# EAGLE design HRV_Control (EAGLE 7.7.0)
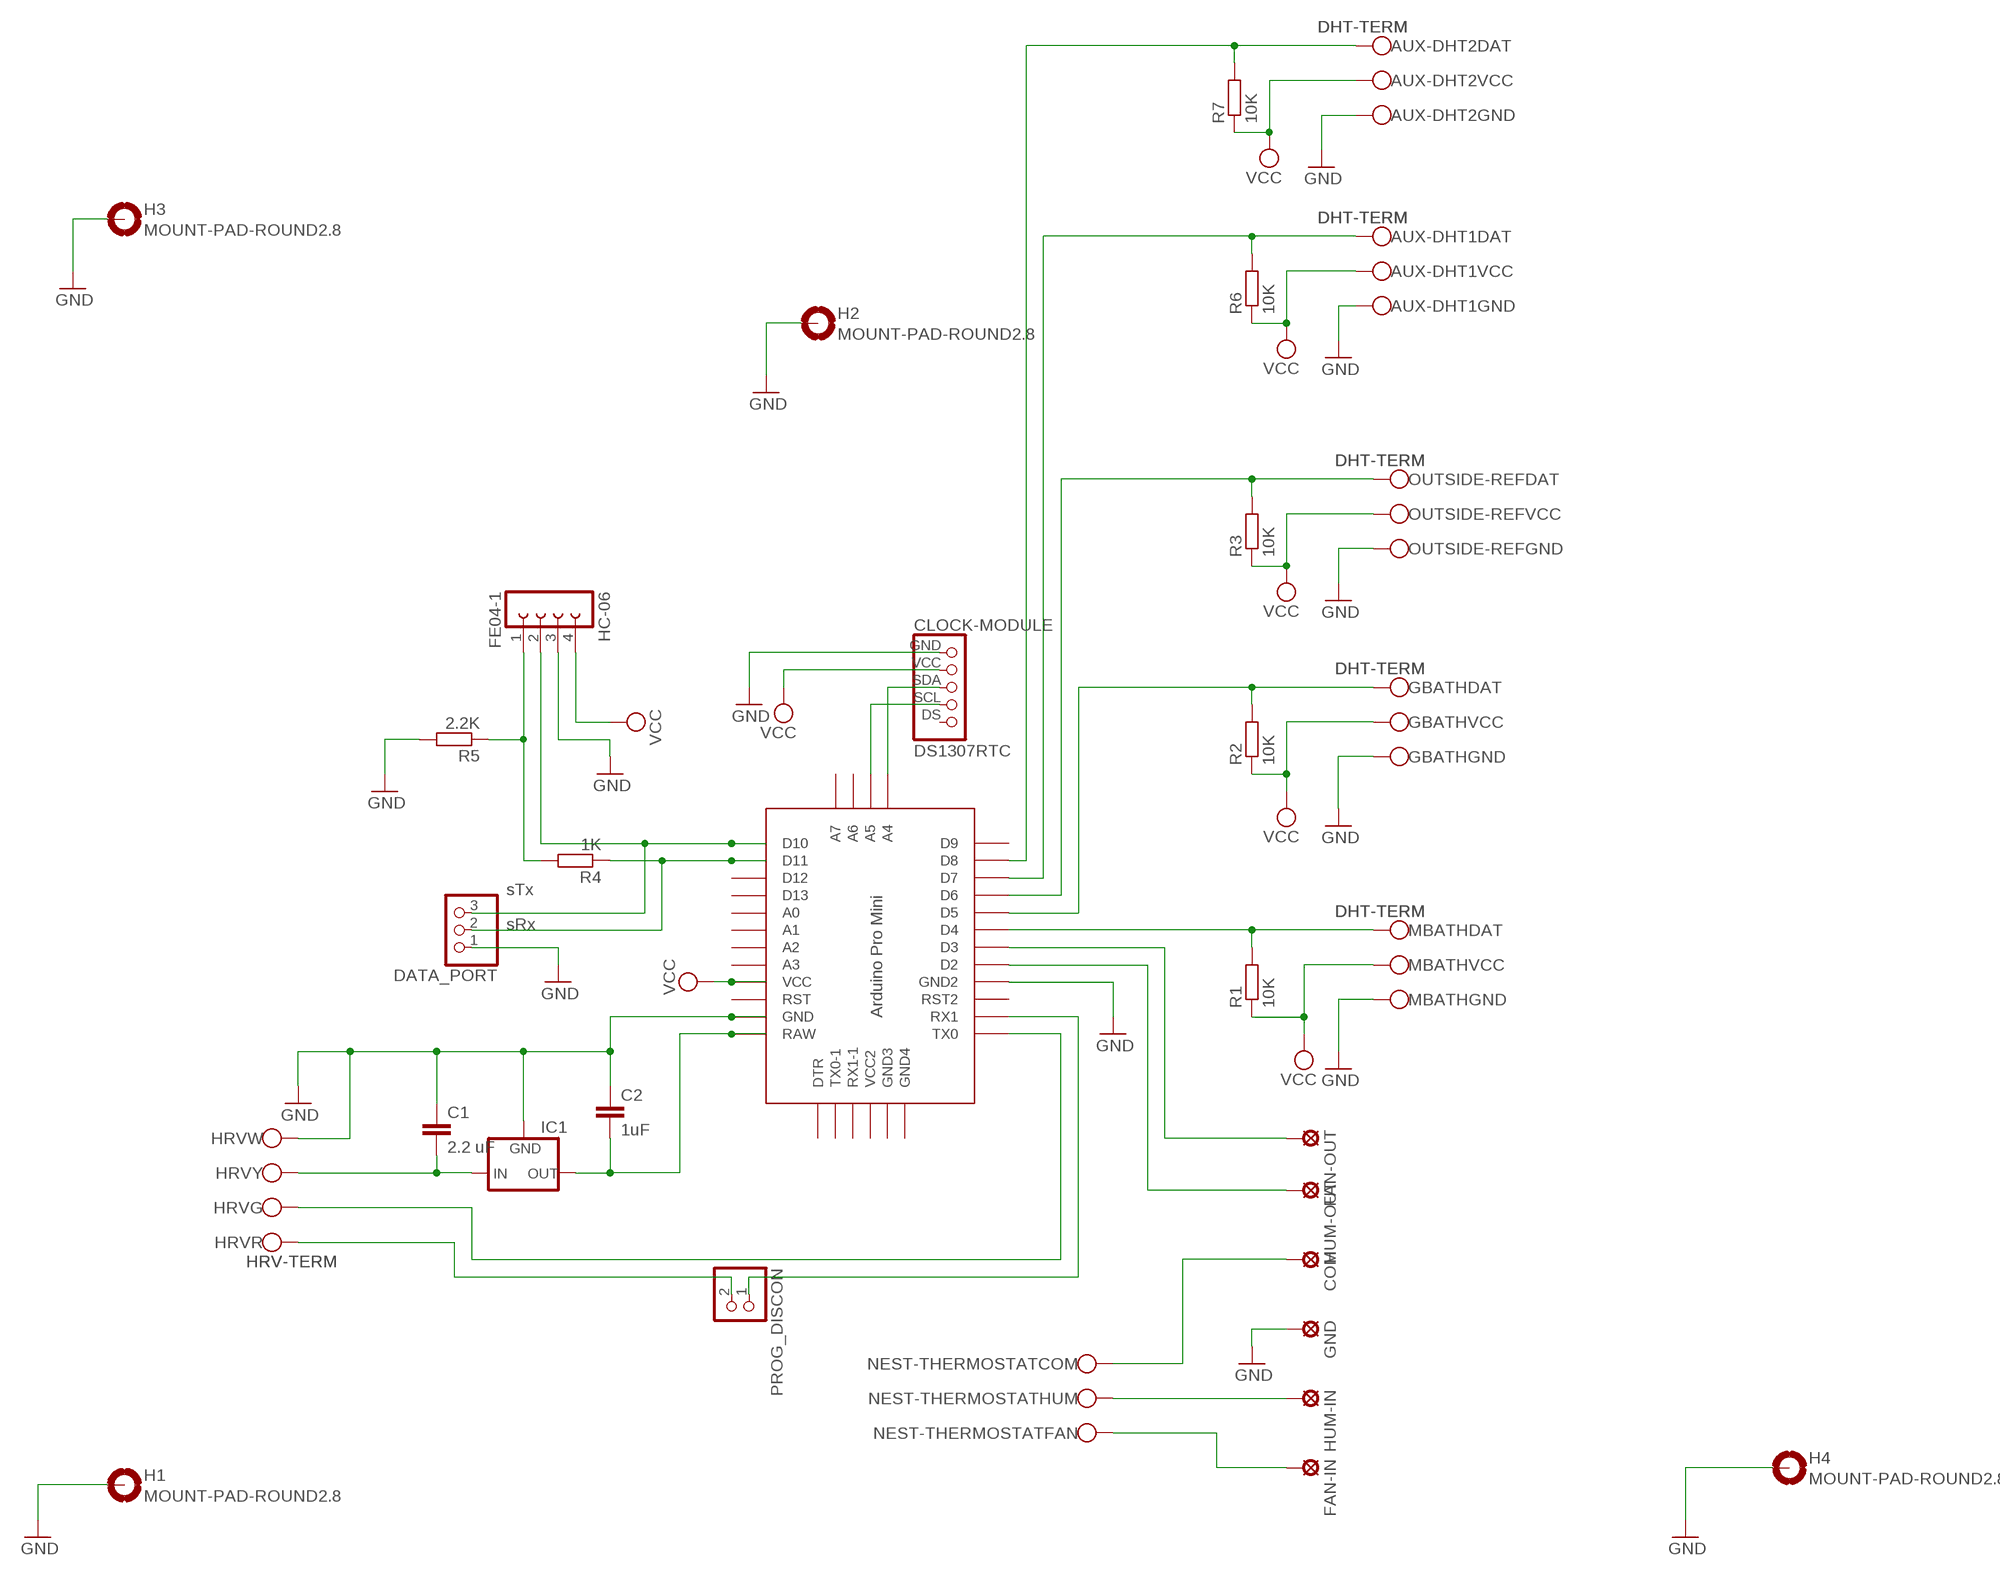
[diagram p0: schematic, sheet 1]

## Parts
AUX-DHT1  DHT-TERM  [DHT-TERMINAL]
AUX-DHT2  DHT-TERM  [DHT-TERMINAL]
C1  2.2 uF  C5/3  [C5B3]
C2  1uF  C-EU025-024X044  [C025-024X044]
CLOCK-MODULE  DS1307RTC  [DS1307RTC]
COM  SE14  [SE14]
DATA_PORT  PINHD-1X3  [1X03]
FAN-IN  SE14  [SE14]
FAN-OUT  SE14  [SE14]
GBATH  DHT-TERM  [DHT-TERMINAL]
GND  SE14  [SE14]
H1  MOUNT-PAD-ROUND2.8  [2,8-PAD]
H2  MOUNT-PAD-ROUND2.8  [2,8-PAD]
H3  MOUNT-PAD-ROUND2.8  [2,8-PAD]
H4  MOUNT-PAD-ROUND2.8  [2,8-PAD]
HC-06  FE04-1  [FE04-1]
HRV  HRV-TERM  [HRV-TERM]
HUM-IN  SE14  [SE14]
HUM-OUT  SE14  [SE14]
IC1  78XXL  [78XXL]
MBATH  DHT-TERM  [DHT-TERMINAL]
NEST-THERMOSTAT  NEST-TERM  [NEST-TERM]
OUTSIDE-REF  DHT-TERM  [DHT-TERMINAL]
PROG_DISCON  PINHD-1X2  [1X02]
R1  10K  R-EU_0204/7  [0204/7]
R2  10K  R-EU_0204/7  [0204/7]
R3  10K  R-EU_0204/7  [0204/7]
R4  1K  R-EU_0204/7  [0204/7]
R5  2.2K  R-EU_0204/7  [0204/7]
R6  10K  R-EU_0204/7  [0204/7]
R7  10K  R-EU_0204/7  [0204/7]
U$6  PRO-MINI  [PRO-MINI]

## Nets
GND: AUX-DHT1.GND AUX-DHT2.GND C1.1 C2.1 CLOCK-MODULE.GND DATA_PORT.1 GBATH.GND GND.MP H1.B2,8(MOUNT) H2.B2,8(MOUNT) H3.B2,8(MOUNT) H4.B2,8(MOUNT) HC-06.3 HRV.W IC1.GND MBATH.GND OUTSIDE-REF.GND R5.2 U$6.GND U$6.GND1(GND2)
N$1: C1.2 HRV.Y IC1.IN
N$2: FAN-IN.MP NEST-THERMOSTAT.FAN
N$3: C2.2 IC1.OUT U$6.RAW
N$4: HRV.G U$6.TX0
N$5: PROG_DISCON.1 U$6.RX1
N$7: MBATH.DAT R1.2 U$6.D4
N$8: HC-06.1 R4.2 R5.1
N$10: HUM-IN.MP NEST-THERMOSTAT.HUM
N$11: COM.MP NEST-THERMOSTAT.COM
N$12: OUTSIDE-REF.DAT R3.2 U$6.D6
N$13: GBATH.DAT R2.2 U$6.D5
N$14: FAN-OUT.MP U$6.D3
N$15: HUM-OUT.MP U$6.D2
N$16: HRV.R PROG_DISCON.2
N$17: AUX-DHT1.DAT R6.2 U$6.D7
N$18: AUX-DHT2.DAT R7.2 U$6.D8
SCL: CLOCK-MODULE.SCL U$6.A5
SDA: CLOCK-MODULE.SDA U$6.A4
SRX: DATA_PORT.2 R4.1 U$6.D11
STX: DATA_PORT.3 HC-06.2 U$6.D10
VCC: AUX-DHT1.VCC AUX-DHT2.VCC CLOCK-MODULE.VCC GBATH.VCC HC-06.4 MBATH.VCC OUTSIDE-REF.VCC R1.1 R2.1 R3.1 R6.1 R7.1 U$6.VCC
Unconnected: CLOCK-MODULE.DS U$6.A0 U$6.A1 U$6.A2 U$6.A3 U$6.A6 U$6.A7 U$6.D9 U$6.D12 U$6.D13 U$6.DTR U$6.GND2(GND4) U$6.GND3 U$6.RST U$6.RST1(RST2) U$6.RX1-1 U$6.TX0-1 U$6.VCC1(VCC2)

## Notes on the sheet
- sTx
- sRx

## Library data of the parts
AUX-DHT1 AUX-DHT2 GBATH MBATH OUTSIDE-REF = HRV_Control:DHT-TERM: WAGO SCREW CLAMP
C1 = capacitor-wima:C: CAPACITOR naming: grid - package width
C2 = resistor:C-EU: CAPACITOR, European symbol
CLOCK-MODULE = HRV_Control:DS1307RTC
COM FAN-IN FAN-OUT GND HUM-IN HUM-OUT = solpad:SE14: SOLDER PAD E1553, drill 1,4mm, distributor Buerklin, 07F820
DATA_PORT = pinhead:PINHD-1X3: PIN HEADER
H1-H4 = holes:MOUNT-PAD-ROUND: MOUNTING PAD, round
HC-06 = con-lsta:FE04-1
HRV = HRV_Control:HRV-TERM
IC1 = v-reg:78XXL: VOLTAGE REGULATOR
NEST-THERMOSTAT = HRV_Control:NEST-TERM: WAGO SCREW CLAMP
PROG_DISCON = pinhead:PINHD-1X2: PIN HEADER
R1-R7 = resistor:R-EU_: RESISTOR, European symbol
U$6 = Arduino-clone:PRO-MINI: Arduion Pro Mini Clone V1.0 www.betemcu.cu

## Board
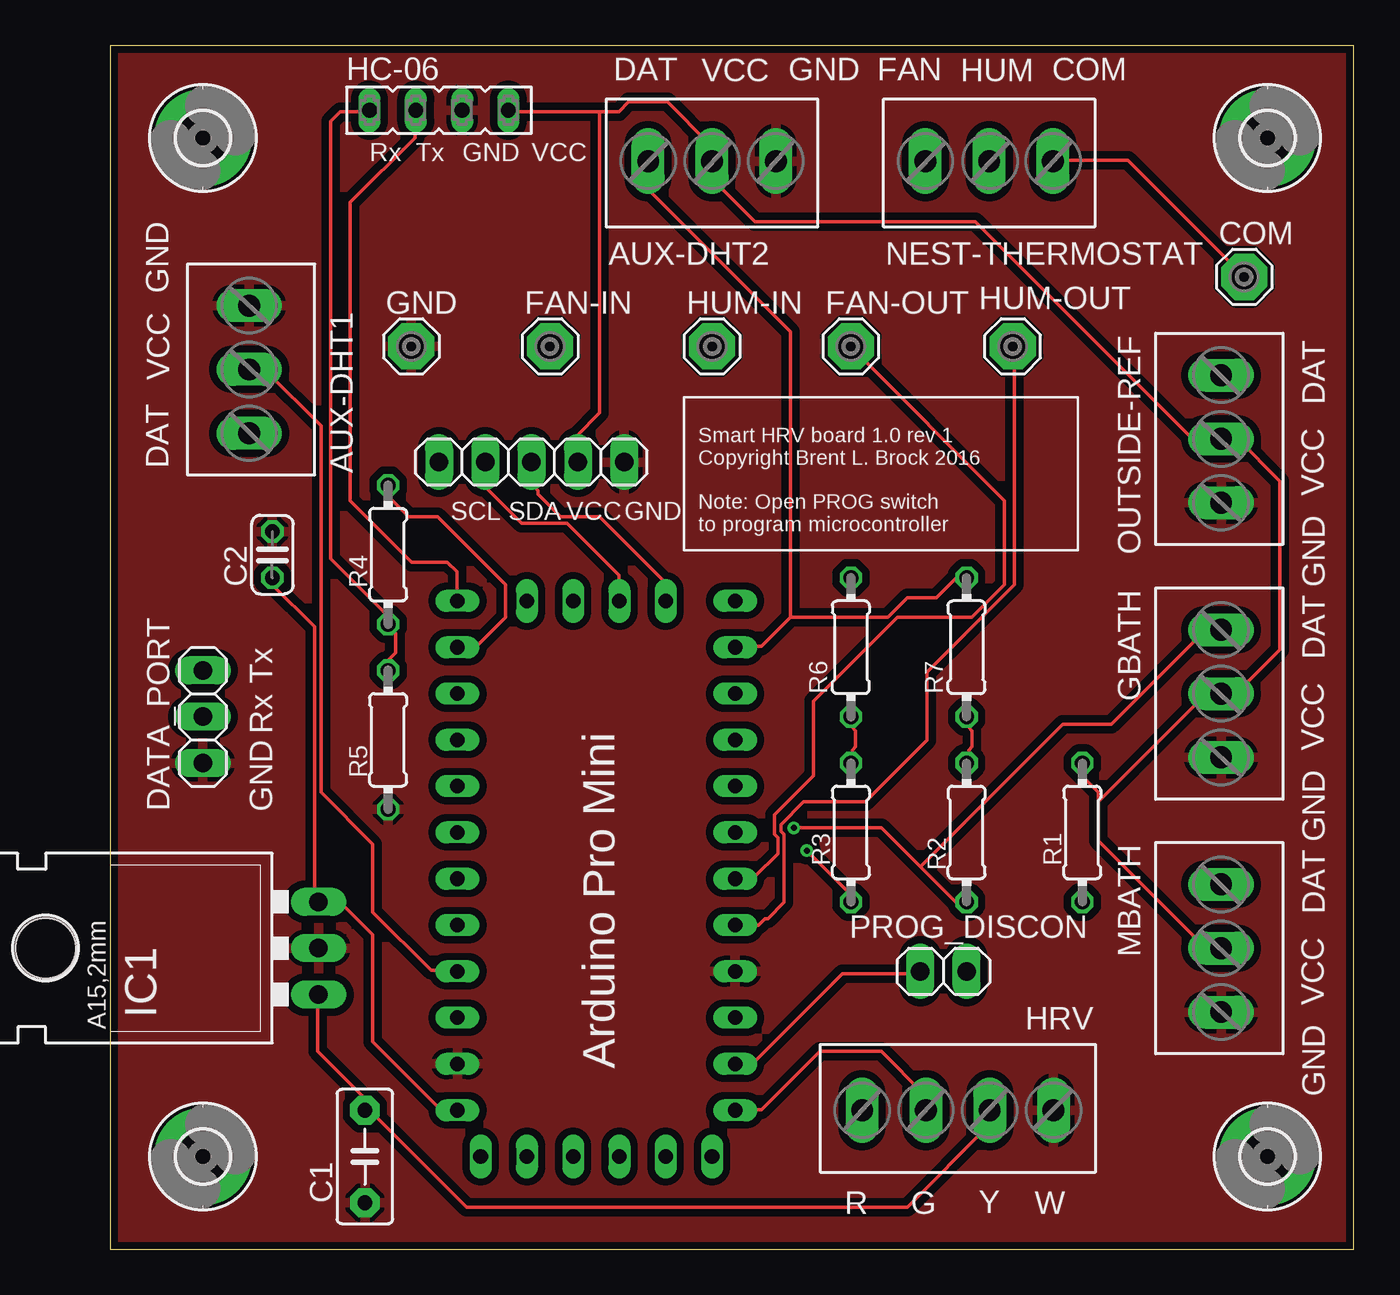
[diagram p1: board, top side]
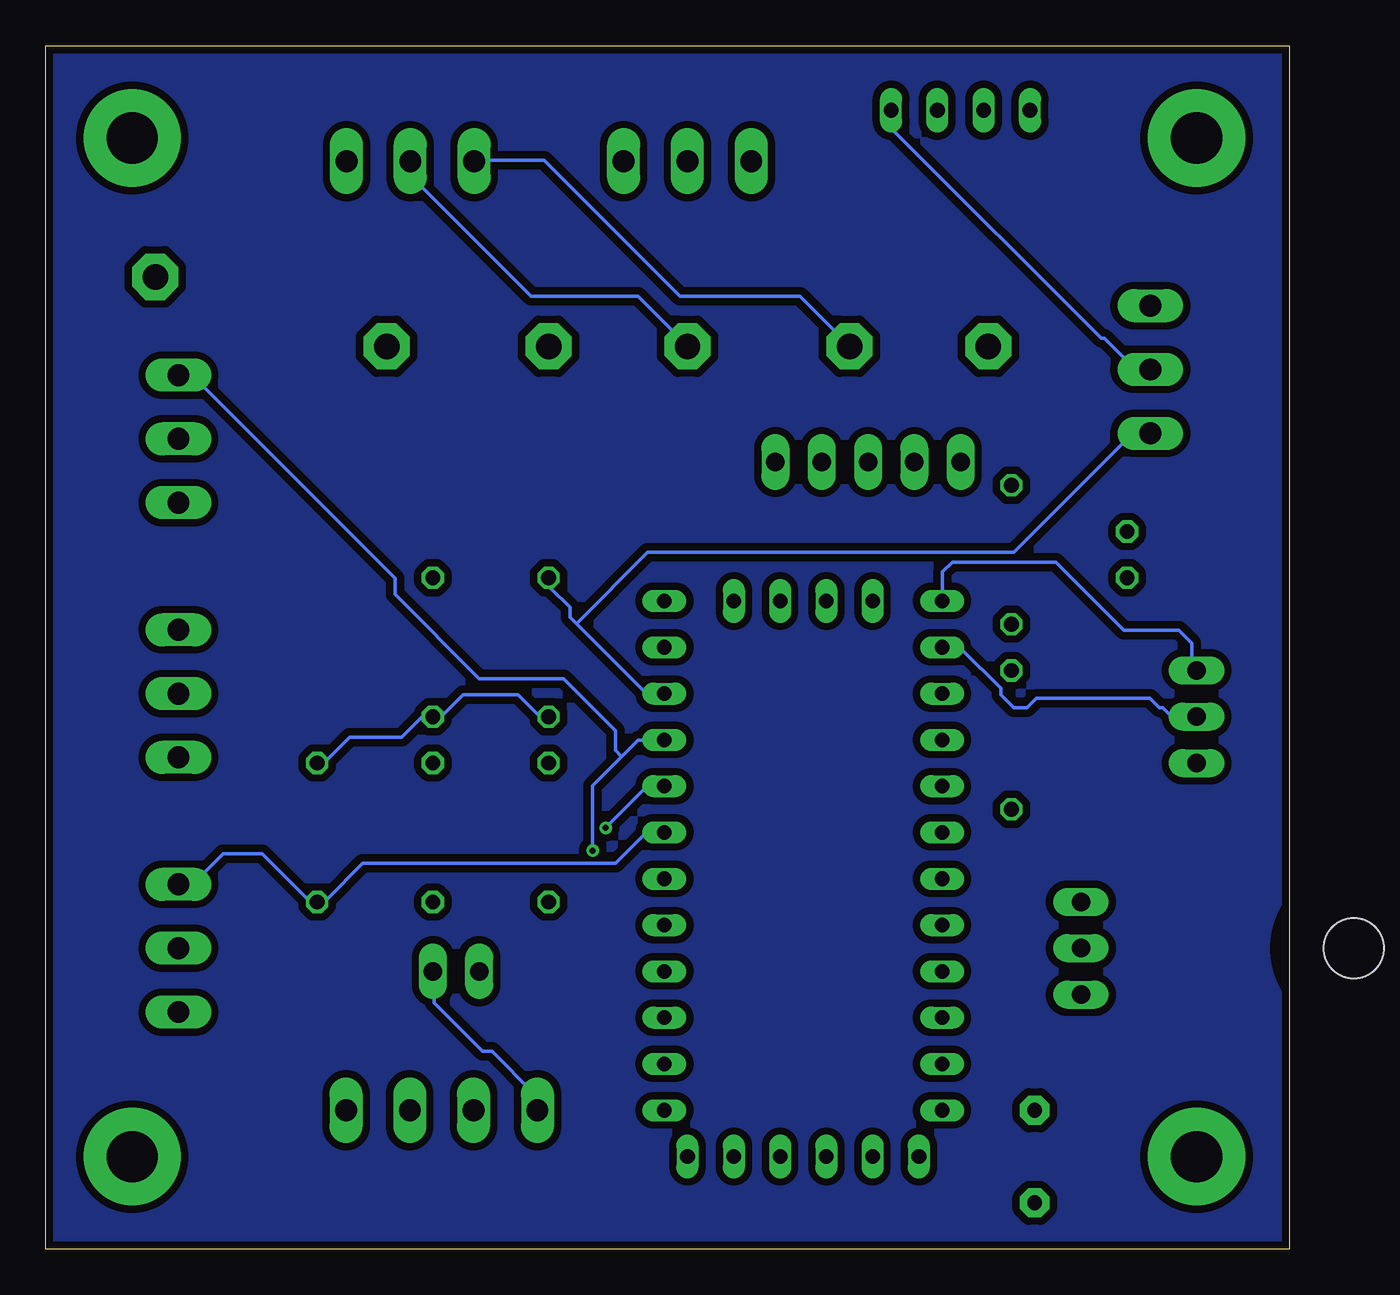
[diagram p2: board, bottom side, seen from below]

Size 68.25 x 66.03 mm. Coordinates in mm from the lower left corner, seen from the top.
Outline: 0,0 68.25,0 68.25,66.03 0,66.03 0,0
Copper layers (1*16): Top 0.0356mm / dielectric 1.5011mm / Bottom 0.0356mm
Design rules "oshpark-2layer *": minimum track width 8mil, minimum drill 13mil, track to track 6mil, track to pad 6mil, pad to pad 6mil, via to via 6mil, smd to smd 6mil, copper to edge 15mil, drill to drill 6mil, minimum pad ring 7mil, minimum via ring 7mil, stop-mask expansion 2.5mil, vias tented up to drill 0mil, thermal gap 10mil

### Footprints (pad centres in the part's own frame; a part is rotated, then mirrored left to right if it is on the bottom)
DHT-TERMINAL = drill 1.2 long: DAT -3.5,0; GND 3.5,0; VCC 0,0
C5B3 = drill 0.813 pad 1.6 octagon: 1 -2.54,0; 2 2.54,0
C025-024X044 = drill 0.813 octagon: 1 -1.27,0; 2 1.27,0
DS1307RTC = drill 1.016 long: DS 5.08,0; GND -5.08,0; SCL 2.54,0; SDA 0,0; VCC -2.54,0
SE14 = drill 1.397 pad 2.54 octagon: MP 0,0
1X03 = drill 1.016 long: 1 -2.54,0; 2 0,0; 3 2.54,0
2,8-PAD = drill 2.8 pad 5.334: B2,8 0,0
FE04-1 = drill 0.813 long: 1 -5.08,0; 2 -2.54,0; 3 0,0; 4 2.54,0
HRV-TERM = drill 1.2 long: G 3.5,0; R 7,0; W -3.5,0; Y 0,0
78XXL = drill 1.016 long: GND 0,-3.81; IN -2.54,-3.81; OUT 2.54,-3.81 | hole 3.302: 0,11.176
NEST-TERM = drill 1.2 long: COM 3.47,0; FAN -3.53,0; HUM -0.03,0
1X02 = drill 1.016 long: 1 -1.27,0; 2 1.27,0
0204/7 = drill 0.813 octagon: 1 -3.81,0; 2 3.81,0
PRO-MINI = drill 0.8 long: A0 8.89,8.89; A1 8.89,11.43; A2 8.89,13.97; A3 8.89,16.51; A4 -2.54,-1.27; A5 0,-1.27; A6 2.54,-1.27; A7 5.08,-1.27; D2 -6.35,16.51; D3 -6.35,13.97; D4 -6.35,11.43; D5 -6.35,8.89; D6 -6.35,6.35; D7 -6.35,3.81; D8 -6.35,1.27; D9 -6.35,-1.27; D10 8.89,-1.27; D11 8.89,1.27; D12 8.89,3.81; D13 8.89,6.35; DTR 7.62,29.21; GND 8.89,24.13; GND1 -6.35,19.05; GND2 -5.08,29.21; GND3 -2.54,29.21; RAW 8.89,26.67; RST 8.89,21.59; RST1 -6.35,21.59; RX1 -6.35,24.13; RX1-1 2.54,29.21; TX0 -6.35,26.67; TX0-1 5.08,29.21; VCC 8.89,19.05; VCC1 0,29.21

### Placement (x,y rotation side)
AUX-DHT1  7.62,48.26 90 top
AUX-DHT2  33.02,59.69 0 top
C1  13.97,5.08 90 top
C2  8.89,38.1 270 top
CLOCK-MODULE  23.11,43.18 180 top
COM  62.23,53.34 0 top
DATA_PORT  5.08,29.21 90 top
FAN-IN  24.13,49.53 0 top
FAN-OUT  40.64,49.53 0 top
GBATH  60.96,30.48 270 top
GND  16.51,49.53 0 top
H1  5.08,5.08 0 top
H2  63.5,60.96 0 top
H3  5.08,60.96 0 top
H4  63.5,5.08 0 top
HC-06  19.3,62.48 0 top
HRV  48.26,7.62 180 top
HUM-IN  33.02,49.53 0 top
HUM-OUT  49.53,49.53 180 top
IC1  7.62,16.51 90 top
MBATH  60.96,16.51 270 top
NEST-THERMOSTAT  48.26,59.69 0 top
OUTSIDE-REF  60.96,44.45 270 top
PROG_DISCON  45.72,15.24 0 top
R1  53.34,22.86 270 top
R2  46.99,22.86 270 top
R3  40.64,22.86 270 top
R4  15.24,38.1 270 top
R5  15.24,27.94 270 top
R6  40.64,33.02 90 top
R7  46.99,33.02 90 top
U$6  27.94,34.29 180 top

### Tracks (layer width: path | path; a pad name or v marks a point on that pad's centre or on a via)
GND
  pour Top (isolate 0.406): 0,66.04 0,0 68.58,0 68.58,66.04
N$1
  Top 0.203: IC1.IN 11.38,13.87 11.38,10.85 13.87,8.36 13.87,7.64 C1.2 14.05,7.47 14.4,7.47 19.56,2.31 43.74,2.31 48.18,6.76 48.18,7.47 HRV.Y
N$2
  Bottom 0.203: NEST-THERMOSTAT.FAN 44.63,59.74 40.89,59.74 33.43,52.27 26.85,52.27 24.18,49.61 FAN-IN.MP
N$3
  Top 0.203: U$6.RAW 19.02,7.64 18.14,7.64 14.4,11.38 14.4,17.25 12.62,19.02 11.56,19.02 IC1.OUT 11.38,19.2 11.2,19.38 11.2,34.14 8.89,36.45 C2.2
N$4
  Top 0.203: U$6.TX0 34.31,7.64 35.74,7.64 38.94,10.85 42.32,10.85 44.63,8.53 44.63,7.64 HRV.G
N$5
  Top 0.203: U$6.RX1 34.31,10.31 35.38,10.31 40.18,15.11 44.45,15.11 PROG_DISCON.1
N$7
  Bottom 0.203: 53.34,19.2 52.81,19.2 50.85,21.16 36.98,21.16 35.38,22.76 34.31,22.76 U$6.D4 | 53.34,19.2 53.87,19.2 56.36,21.69 58.5,21.69 60.1,20.09 60.81,20.09 MBATH.DAT | 53.34,19.2 R1.2
N$8
  Top 0.203: R5.1 15.29,31.83 15.29,32.36 15.65,32.72 15.65,33.78 15.29,34.14 R4.2 15.11,34.31 15.11,34.85 12.09,37.87 12.09,61.87 12.62,62.41 14.22,62.41 HC-06.1
N$10
  Bottom 0.203: NEST-THERMOSTAT.HUM 48.18,59.56 48.18,58.85 41.6,52.27 35.74,52.27 33.07,49.61 HUM-IN.MP
N$11
  Top 0.203: COM.MP 55.83,59.74 51.74,59.74 NEST-THERMOSTAT.COM
N$12  (via drill 0.33)
  Top 0.203: v38.23,21.87 40.54,19.56 40.54,19.2 R3.2
  Bottom 0.203: 36.63,27.03 38.23,25.43 v38.23,21.87 | 36.63,27.03 35.74,27.91 34.31,27.91 U$6.D6 | 36.63,27.03 36.98,27.38 36.98,28.45 39.83,31.29 44.45,31.29 49.07,35.92 49.07,36.8 60.1,47.83 60.81,47.83 OUTSIDE-REF.DAT
N$13  (via drill 0.33)
  Top 0.203: v37.52,23.11 42.32,23.11 44.45,20.98 | 44.45,20.98 46.41,19.02 46.94,19.02 R2.2 | 44.45,20.98 52.27,28.8 54.94,28.8 60.1,33.96 60.81,33.96 GBATH.DAT
  Bottom 0.203: v37.52,23.11 35.38,25.25 34.31,25.25 U$6.D5
N$14
  Top 0.203: U$6.D3 34.31,20.45 35.38,20.45 36.63,21.69 36.63,22.58 36.45,22.76 36.45,23.82 38.58,25.96 38.58,30.05 43.2,34.67 47.3,34.67 49.07,36.45 49.07,41.07 40.72,49.43 FAN-OUT.MP
N$15
  Top 0.203: U$6.D2 35.56,17.78 35.92,18.14 36.09,18.14 36.98,19.02 36.98,22.76 36.8,22.94 36.8,23.29 38.05,24.54 41.43,24.54 44.81,27.91 44.81,31.65 49.61,36.45 49.61,49.43 HUM-OUT.MP
N$16
  Bottom 0.203: PROG_DISCON.2 46.94,15.11 46.94,13.51 44.27,10.85 43.74,10.85 41.43,8.53 41.43,7.64 HRV.R
N$17
  Bottom 0.203: 39.12,34.31 39.47,34.67 39.47,35.2 40.54,36.27 40.54,36.8 R6.2 | 39.12,34.31 35.38,30.58 34.31,30.58 U$6.D7 | 39.12,34.31 35.2,38.23 15.11,38.23 8.71,44.63 7.64,44.63 AUX-DHT1.DAT
N$18
  Top 0.203: 37.34,34.67 35.74,33.07 34.31,33.07 U$6.D8 | 37.34,34.67 42.67,34.67 43.74,35.74 45.34,35.74 46.41,36.8 46.94,36.8 R7.2 | 37.34,34.67 37.34,50.32 29.69,57.96 29.69,59.56 AUX-DHT2.DAT
N$21
  pour Bottom (isolate 0.406): 0,66.04 68.58,66.04 68.58,0 0,0
SCL
  Top 0.203: U$6.A5 27.91,35.56 27.91,36.98 25.07,39.83 22.58,39.83 20.62,41.78 20.62,43.03 CLOCK-MODULE.SCL
SDA
  Top 0.203: CLOCK-MODULE.SDA 23.11,41.96 23.47,41.6 23.47,41.43 24.71,40.18 26.85,40.18 30.4,36.63 30.4,35.56 U$6.A4
SRX
  Top 0.203: U$6.D11 19.2,33.07 20.09,33.07 21.69,34.67 21.69,36.45 17.96,40.18 16.36,40.18 15.29,41.25 15.29,41.78 R4.1
  Bottom 0.203: DATA_PORT.2 5.16,29.34 6.58,29.34 6.93,29.69 7.11,29.69 7.64,30.23 13.87,30.23 14.4,29.69 15.11,29.69 15.82,30.4 15.82,30.76 17.96,32.89 19.02,32.89 U$6.D11
STX
  Top 0.203: HC-06.2 16.71,62.41 16.71,60.98 13.16,57.43 13.16,41.07 16.54,37.69 18.49,37.69 19.02,37.16 19.02,35.56 U$6.D10
  Bottom 0.203: DATA_PORT.3 5.33,32 5.33,33.25 6.04,33.96 9.07,33.96 12.8,37.69 18.49,37.69 19.02,37.16 19.02,35.56 U$6.D10
VCC
  Top 0.203: R3.1 40.72,26.67 40.72,27.38 40.89,27.56 40.89,28.45 40.72,28.63 40.72,29.16 R6.1 | R2.1 47.12,26.67 47.12,27.38 47.3,27.56 47.3,28.45 47.12,28.63 47.12,29.16 R7.1 | 54.23,24.54 54.23,25.07 53.16,26.14 53.16,26.49 R1.1 | 54.23,24.54 54.23,22.4 60.1,16.54 60.81,16.54 MBATH.VCC | 54.23,24.54 60.1,30.4 60.81,30.4 GBATH.VCC 60.98,30.58 61.87,30.58 64.19,32.89 64.19,42.14 61.87,44.45 OUTSIDE-REF.VCC 59.38,44.45 47.47,56.36 35.38,56.36 33.07,58.67 33.07,59.56 AUX-DHT2.VCC 32.89,59.74 32.89,60.63 30.58,62.94 28.45,62.94 27.91,62.41 26.85,62.41 | 26.85,62.41 21.87,62.41 HC-06.4 | 26.85,62.41 26.85,45.87 25.6,44.63 25.6,43.2 CLOCK-MODULE.VCC | U$6.VCC 19.02,15.29 17.6,15.29 14.4,18.49 14.4,22.23 11.56,25.07 11.56,45.16 8.53,48.18 7.64,48.18 AUX-DHT1.VCC
  Bottom 0.203: R1.1 52.98,26.67 51.56,28.09 48.72,28.09 47.65,29.16 47.12,29.16 R7.1 46.94,29.34 46.41,29.34 45.34,30.4 42.32,30.4 41.25,29.34 40.72,29.34 R6.1 | HC-06.4 21.69,62.41 21.69,61.34 10.31,49.96 10.13,49.96 8.53,48.36 7.64,48.36 AUX-DHT1.VCC

### Text on the board
_tsilk: Rx | Tx | GND | VCC | SCL | SDA | VCC | GND | Smart HRV board 1.0 rev 1 / Copyright Brent L. Brock 2016 / / Note: Open PROG switch / to program microcontroller | Tx | Rx | GND | Arduino Pro Mini